# EAGLE schematic afron_shield (EAGLE 6.1)
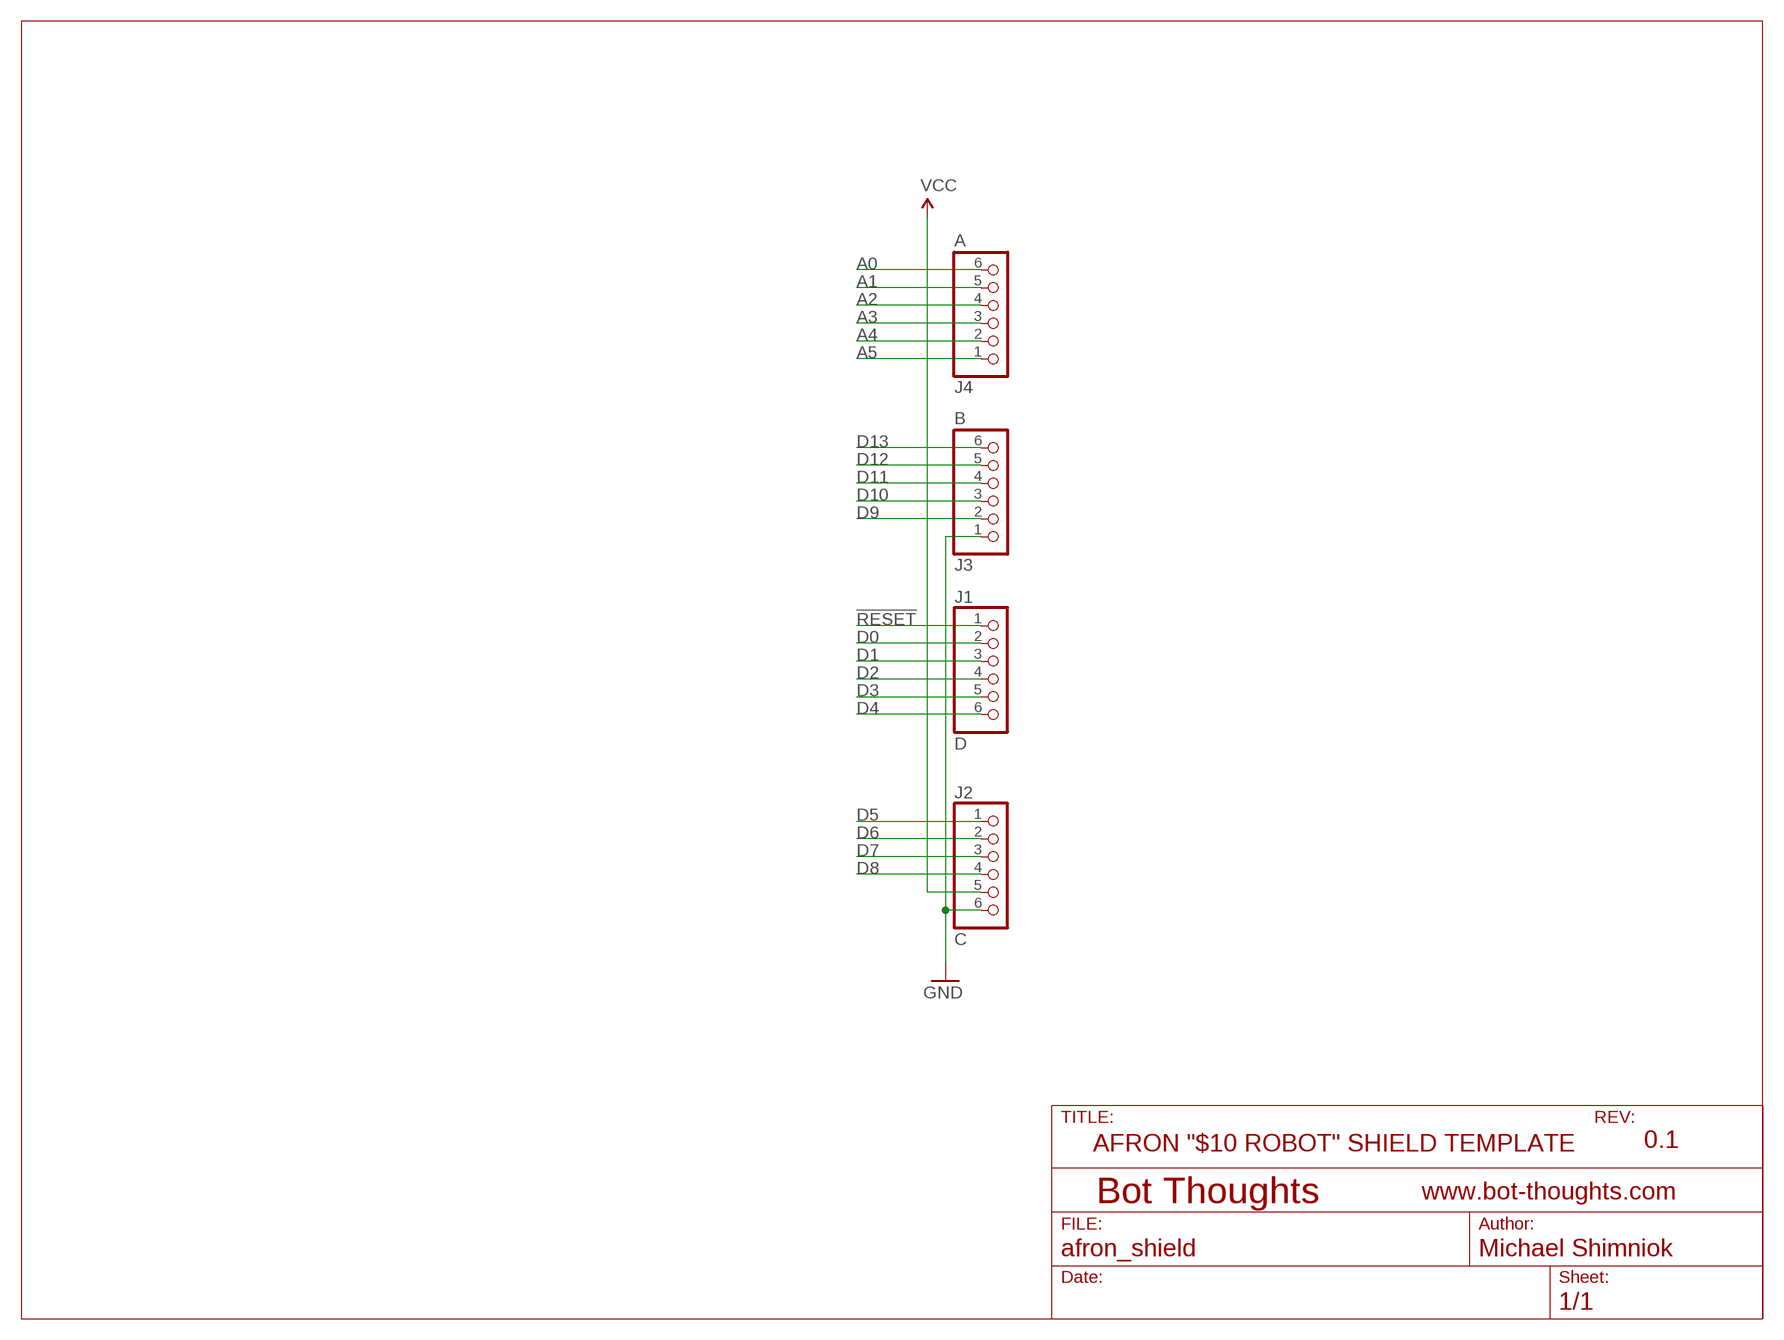
[diagram p0: schematic, sheet 1]

## Parts
J1  D  PINHD-1X06_2.54-S  [1X06-S]
J2  C  PINHD-1X06_2.54-S  [1X06-S]
J3  B  PINHD-1X06_2.54-S  [1X06-S]
J4  A  PINHD-1X06_2.54-S  [1X06-S]

## Nets
!RESET: J1.1
A0: J4.6
A1: J4.5
A2: J4.4
A3: J4.3
A4: J4.2
A5: J4.1
D0: J1.2
D1: J1.3
D2: J1.4
D3: J1.5
D4: J1.6
D5: J2.1
D6: J2.2
D7: J2.3
D8: J2.4
D9: J3.2
D10: J3.3
D11: J3.4
D12: J3.5
D13: J3.6
GND: J2.6 J3.1
VCC: J2.5

## Notes on the sheet
- AFRON "$10 ROBOT" SHIELD TEMPLATE | 0.1

## Library data of the parts
J1-J4 = pinhead-2:PINHD-1X06: PIN HEADER